# Altium project WatchX.PrjPcb
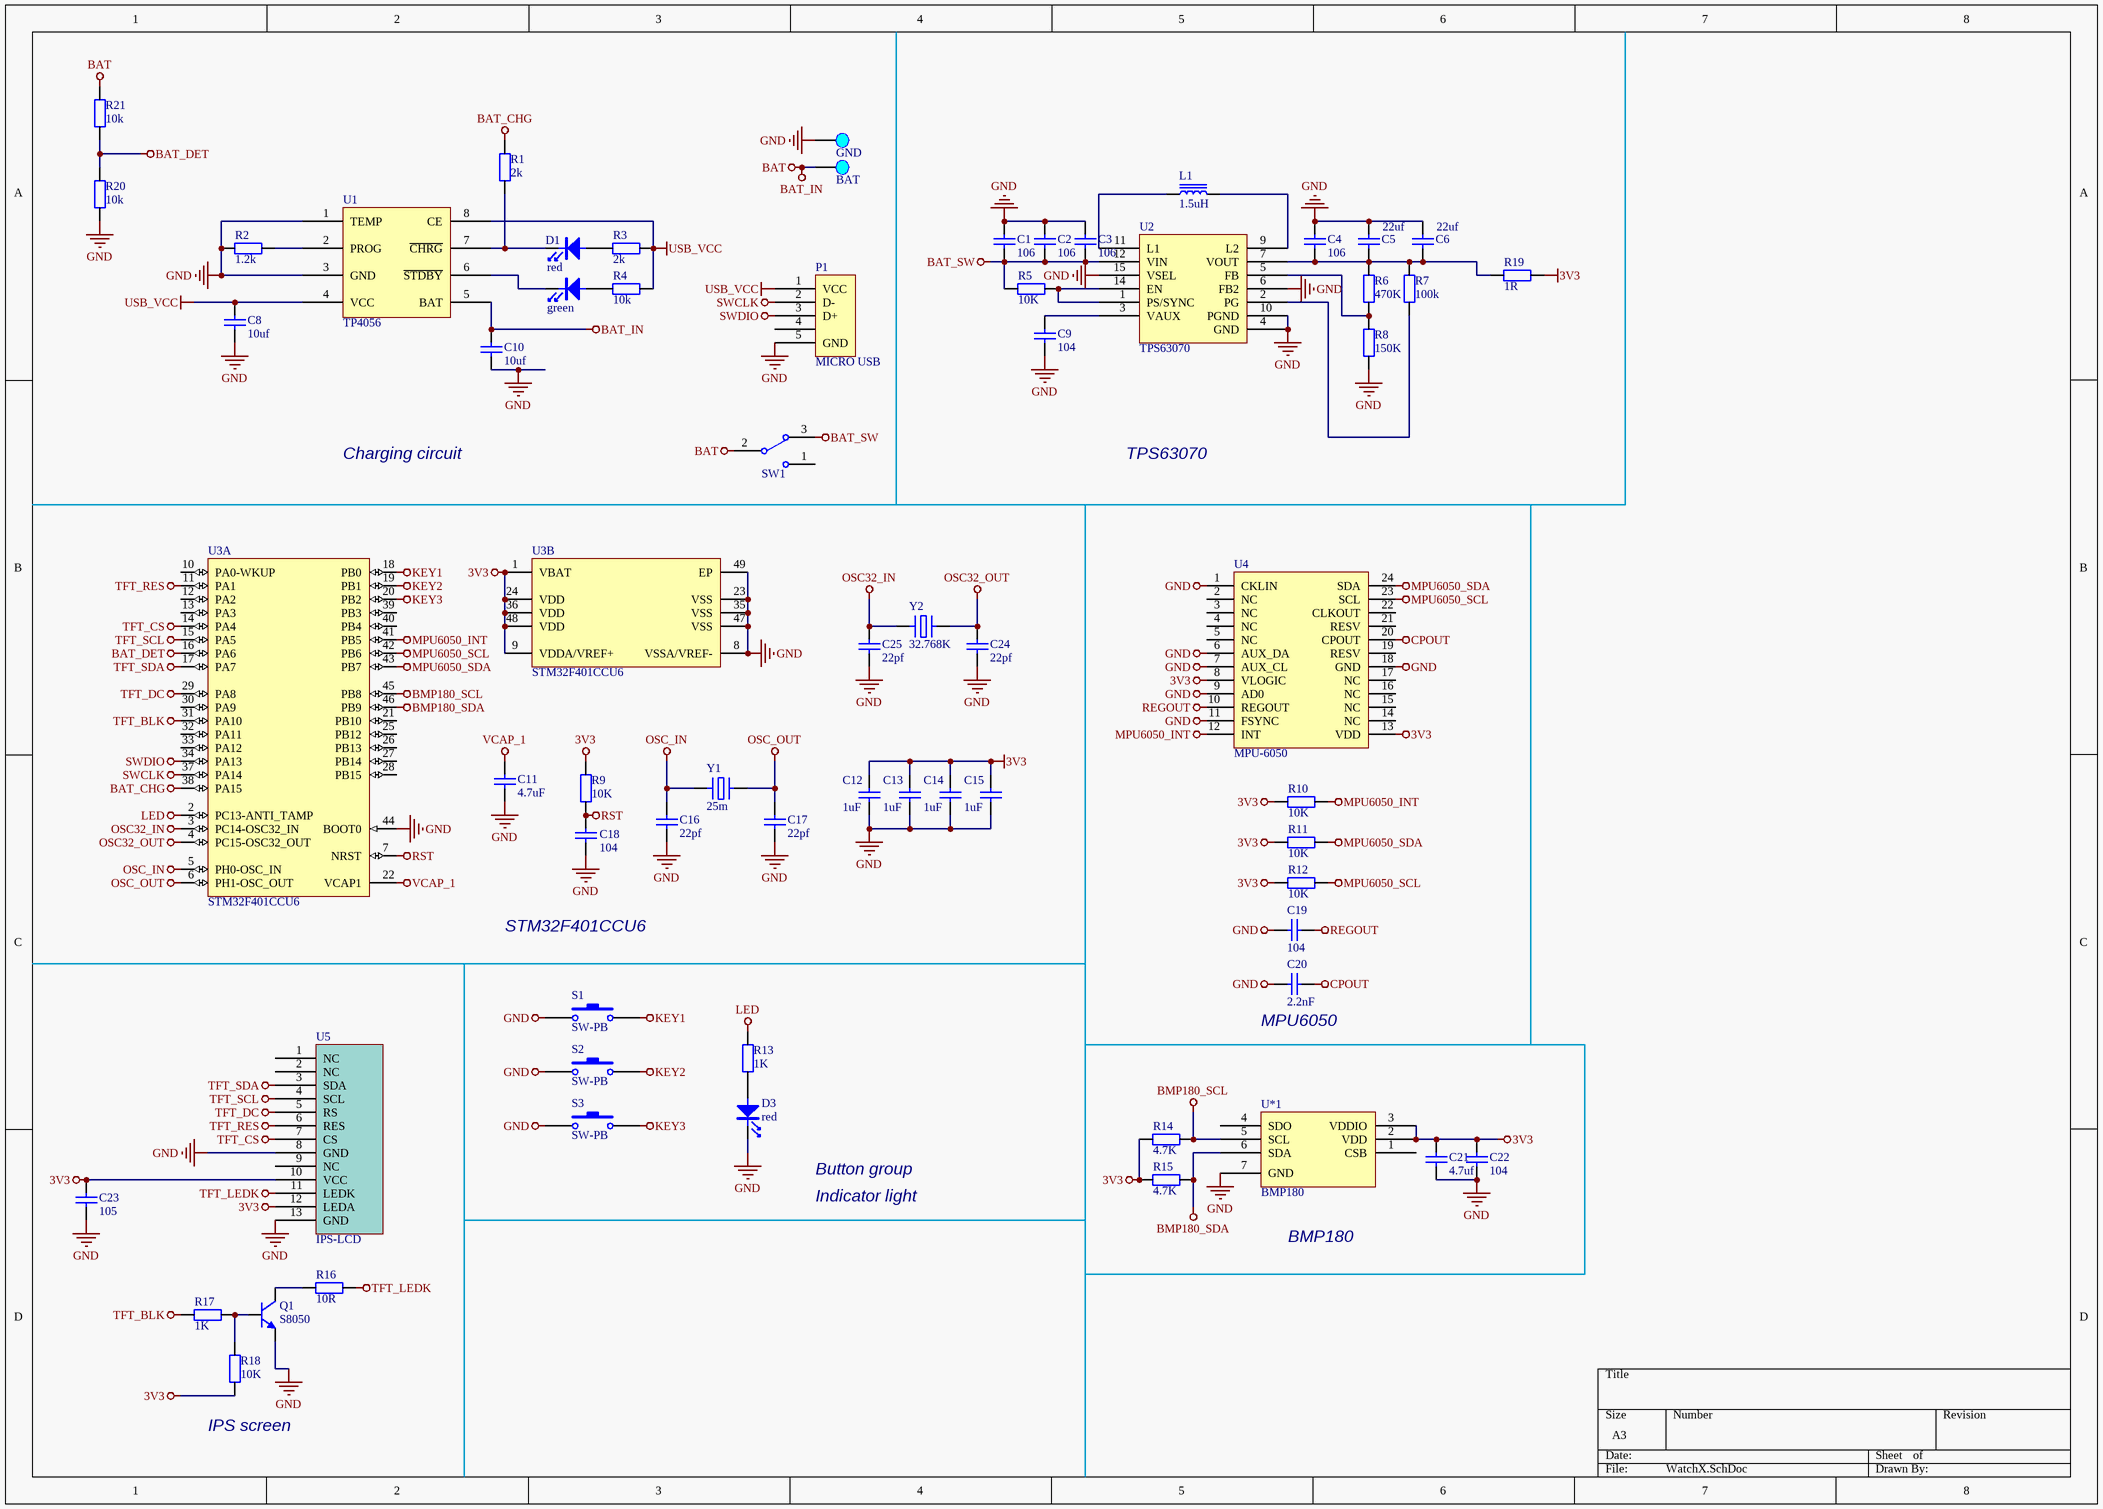
[diagram p0: WatchX.SchDoc]
1 sheet, 65 parts. Net scope: global (net labels, ports and power ports of the same name join across sheets).
Board file: WatchX.PcbDoc

## Sheet WatchX.SchDoc: WatchX
size A3

### Parts
C1  106  [电容_C0805]
C2  106  [电容_C0805]
C3  106  [电容_C0603]
C4  106  [电容_C0603]
C5  22uf  [电容_C1206]
C6  22uf  [电容_C1206]
C8  10uf  [电容_C0603]
C9  104  [电容_C0603]
C10  10uf  [电容_C0603]
C11  4.7uF  [电容_C0603]
C12  1uF  [电容_C0603]
C13  1uF  [电容_C0603]
C14  1uF  [电容_C0603]
C15  1uF  [电容_C0603]
C16  22pf  [电容_C0603]
C17  22pf  [电容_C0603]
C18  104  [电容_C0603]
C19  104  [电容_C0603]
C20  2.2nF  [电容_C0603]
C21  4.7uf  [电容_C0603]
C22  104  [电容_C0603]
C23  105  [电容_C0603]
C24  22pf  [电容_C0603]
C25  22pf  [电容_C0603]
D1  red  [LED_0603]
D2  green  [LED_0603]
D3  red  [LED_0603]
L1  1.5uH  [变压器电感_0420]
P1  MICRO USB  [接插件_MICRO 牛角插座 USB 卷边]
Pad1  GND  [Pad_A]
Pad2  BAT  [Pad_A]
Q1  S8050  [三极管_SOT-23]
R1  2k  [电阻_R0603]
R2  1.2k  [电阻_R0603]
R3  2k  [电阻_R0603]
R4  R: 10k  [电阻_R0603]  (hidden comment: 2k)
R5  10K  [电阻_R0603]
R6  470K  [电阻_R0603]
R7  100k  [电阻_R0603]
R8  150K  [电阻_R0603]
R9  10K  [电阻_R0603]
R10  10K  [电阻_R0603]
R11  10K  [电阻_R0603]
R12  10K  [电阻_R0603]
R13  1K  [电阻_R0603]
R14  4.7K  [电阻_R0603]
R15  4.7K  [电阻_R0603]
R16  10R  [电阻_R0603]
R17  1K  [电阻_R0603]
R18  10K  [电阻_R0603]
R19  1R  [电阻_R0603]
R20  10k  [电阻_R0603]
R21  10k  [电阻_R0603]
S1  SW-PB  [KEY_3.5*4.7]
S2  SW-PB  [KEY_3.5*4.7]
S3  SW-PB  [KEY_3.5*4.7]
SW1  SPDT  [MSS3-Q-T/R]  (value not drawn)
U1  TP4056  [SOP8]
U2  TPS63070  [VQFN-15-HR]
U3  STM32F401CCU6  [STM-UFQFPN48_N]  (parts A,B of 2)
U4  MPU-6050  [陀螺仪_QFN24]
U5  IPS-LCD  [1.14IPS-LCD]
U*1  BMP180  [LGA-7]
Y1  F: 25m  [晶振_2016]  (hidden comment: XTAL)
Y2  32.768K  [晶振_3215]

### Nets
3V3: C12.2 C13.2 C14.2 C15.2 C21.2 C22.2 C23.2 R9.2 R10.2 R11.2 R12.2 R14.2 R15.2 R18.1 R19.2 U3.1(VBAT) U3.9(VDDA/VREF+) U3.24(VDD) U3.36(VDD) U3.48(VDD) U4.8(VLOGIC) U4.13(VDD) U5.10(VCC) U5.12(LEDA) U*1.2(VDD) U*1.3(VDDIO)
BAT: C10.2 Pad2.1 R21.2 SW1.2 U1.5(BAT)  [also labelled BAT_IN]
BAT_CHG: R1.2 U3.38(PA15)
BAT_DET: R20.2 R21.1 U3.16(PA6)
BAT_SW: C1.1 C2.1 C3.1 R5.2 SW1.3 U2.12(VIN)
BMP180_SCL: R14.1 U3.45(PB8) U*1.5(SCL)
BMP180_SDA: R15.1 U3.46(PB9) U*1.6(SDA)
CPOUT: C20.2 U4.20(CPOUT)
GND: C1.2 C2.2 C3.2 C4.2 C5.2 C6.2 C8.1 C9.1 C10.1 C11.1 C12.1 C13.1 C14.1 C15.1 C16.2 C17.2 C18.1 C19.1 C20.1 C21.1 C22.1 C23.1 C24.2 C25.2 D3.K P1.0 P1.5(GND) Pad1.1 Q1.3(E) R2.1 R8.2 R20.1 S1.1 S2.1 S3.1 U1.0(GND) U1.1(TEMP) U1.3(GND) U2.4(GND) U2.6(FB2) U2.10(PGND) U2.15(VSEL) U3.8(VSSA/VREF-) U3.23(VSS) U3.35(VSS) U3.44(BOOT0) U3.47(VSS) U3.49(EP) U4.0 U4.1(CKLIN) U4.6(AUX_DA) U4.7(AUX_CL) U4.9(AD0) U4.11(FSYNC) U4.18(GND) U5.8(GND) U5.13(GND) U*1.7(GND)
KEY1: S1.2 U3.18(PB0)
KEY2: S2.2 U3.19(PB1)
KEY3: S3.2 U3.20(PB2)
LED: R13.1 U3.2(PC13-ANTI_TAMP)
MPU6050_INT: R10.1 U3.41(PB5) U4.12(INT)
MPU6050_SCL: R12.1 U3.42(PB6) U4.23(SCL)
MPU6050_SDA: R11.1 U3.43(PB7) U4.24(SDA)
OSC32_IN: C25.1 U3.3(PC14-OSC32_IN) Y2.1
OSC32_OUT: C24.1 U3.4(PC15-OSC32_OUT) Y2.2
OSC_IN: C16.1 U3.5(PH0-OSC_IN) Y1.1
OSC_OUT: C17.1 U3.6(PH1-OSC_OUT) Y1.2
REGOUT: C19.2 U4.10(REGOUT)
RST: C18.2 R9.1 U3.7(NRST)
SWCLK: P1.2(D-) U3.37(PA14)
SWDIO: P1.3(D+) U3.34(PA13)
TFT_BLK: R17.1 U3.31(PA10)
TFT_CS: U3.14(PA4) U5.7(CS)
TFT_DC: U3.29(PA8) U5.5(RS)
TFT_LEDK: R16.2 U5.11(LEDK)
TFT_RES: U3.11(PA1) U5.6(RES)
TFT_SCL: U3.15(PA5) U5.4(SCL)
TFT_SDA: U3.17(PA7) U5.3(SDA)
USB_VCC: C8.2 P1.1(VCC) R3.2 R4.2 U1.4(VCC) U1.8(CE)
VCAP_1: C11.2 U3.22(VCAP1)
NetC4_1: C4.1 C5.1 C6.1 R6.1 R7.1 R19.1 U2.7(VOUT)
NetC9_2: C9.2 U2.3(VAUX)
NetD1_A: D1.A R3.1
NetD1_K: D1.K R1.1 U1.7(~{CHRG})
NetD2_A: D2.A R4.1
NetD2_K: D2.K U1.6(~{STDBY})
NetD3_A: D3.A R13.2
NetL1_1: L1.1 U2.11(L1)
NetL1_2: L1.2 U2.9(L2)
NetQ1_1: Q1.1(B) R17.2 R18.2
NetQ1_2: Q1.2(C) R16.1
NetR2_2: R2.2 U1.2(PROG)
NetR5_1: R5.1 U2.1(PS/SYNC) U2.14(EN)
NetR6_2: R6.2 R8.1 U2.5(FB)
NetR7_2: R7.2 U2.2(PG)

Not connected (* = marked no-connect by the designer): P1 4; SW1 1; U3 10(PA0-WKUP) 12(PA2) 13(PA3) 21(PB10) 25(PB12) 26(PB13) 27(PB14) 28(PB15) 30(PA9) 32(PA11) 33(PA12) 39(PB3) 40(PB4); U4 2(NC) 3(NC) 4(NC) 5(NC) 14(NC) 15(NC) 16(NC) 17(NC) 19(RESV) 21(RESV) 22(CLKOUT); U5 1(NC) 2(NC) 9(NC); U*1 1(CSB) 4(SDO)

### Notes on the sheet
- Charging circuit
- TPS63070
- STM32F401CCU6
- (near C20) MPU6050
- Button group
- Indicator light
- BMP180
- (near R18) IPS screen

### Library data of the parts
C1-C6 C8-C25 = cap: U: 50V; 参数: Cap,0805,X7R,104K,50V,125C,±10%
  C1-C4: C: 106
  C5 C6: C: 22uf
  C8 C10: C: 10uf
  C9 C18 C19 C22: C: 104
  C11: C: 4.7uF
  C12-C15: C: 1uF
  C16 C17 C24 C25: C: 22pf
  C20: C: 2.2nF
  C21: C: 4.7uf
  C23: C: 105
D1-D3 = LED: 参数: LED,0603,Red
L1 = Inductor Iron 2: _Current: 10A; _Accuracy: 20%; _Footprint: 1040; _Name: IND; _Specification: IND,1040,1.5uH,10A,20%; _Comma: ,; _Value: 1.5uH
P1 = MICRO USB 5PIN: _Comma: ,; _Name: Port; _Specification: Port,MICRO USB,5PIN; _Value: 5PIN; _Model: MICRO USB
Pad1 = Pad: _Funcyusa: Test; _Specification: Pad,Test,GND; _Comma: ,; _Name: Pad; _Remarks: GND
Pad2 = Pad: _Funcyusa: Test; _Specification: Pad,Test,BAT; _Comma: ,; _Name: Pad; _Remarks: BAT
Q1 = Triode-NPN: _Comma: ,; _Current: 500mA; _Footprint: SOT-23; _Name: Triode; _Specification: Triode,NPN,S8050,SOT-23,500mA,40V; _Voltage: 40V; _Polarity: NPN; _Model: S8050
R1-R15 R19-R21 = Res: P: 1/8W; 参数: Res,0805,0R,±1%,1/8W,100ppm,155C
  R1 R3: R: 2k
  R2: R: 1.2k
  R5 R9-R12: R: 10K
  R6: R: 470K
  R7: R: 100k
  R8: R: 150K
  R13: R: 1K
  R14 R15: R: 4.7K
  R19: R: 1R
  R20 R21: R: 10k
R16 = Res: _Accuracy: 1%; _Power: 1/8W; _Footprint: 0805; _Drift: 100ppm; _Comma: ,; _Specification: Res,0805,10R,1%,1/8W,100ppm; _Name: Res; _Value: 10R
R17 = Res: _Accuracy: 1%; _Power: 1/8W; _Footprint: 0805; _Drift: 100ppm; _Comma: ,; _Specification: Res,0805,1K,1%,1/8W,100ppm; _Name: Res; _Value: 1K
R18 = Res: _Accuracy: 1%; _Power: 1/8W; _Footprint: 0805; _Drift: 100ppm; _Comma: ,; _Specification: Res,0805,10K,1%,1/8W,100ppm; _Name: Res; _Value: 10K
S1-S3 = SW-PB: 按键
SW1 = SW_SPDT: 开关-两档
U1 = TP4056: 参数: Charge Control,LP4056,ESOP-8
U2 = TPS63070: 降压-升压转换器
U3 = STM32F401CCU6: ARM Cortex-M4 32-bit MCU+FPU, 105 DMIPS, 256 kB Flash, 64 kB Internal RAM, 36 I/Os, 48-pin UFQFPN, -40 to 85 degC, Tray; Manufacturer: STMicroelectronics; FLASH Size (Prog) (kB): 256; I/Os (High Current): 36; Internal RAM Size (kB): 64; Operating Frequency(F) (Processor speed) (MHz): 84; Supply Voltage(Vcc) max (V): 3.6; Supply Voltage(Vcc) min (V): 1.8; DatasheetVersion: Rev. 1; PackageVersion: Rev. 1, 04/2013; PackageReference: UFQFPN48; PackageDescription: 48-Pin Ultra Thin Fine Pitch Quad Flat No-Lead, 7 x 7 x 0.6 mm Body, 0.5 mm Pitch, Exposed Pad; Supplier 1: Newark; Supplier Part Number 1: 19X6217; Supplier 2: Mouser; Supplier Part Number 2: 511-STM32F401CCU6; Core: ARM Cortex-M4; Packing: Tray; Mounting Technology: Surface Mount; PartNumber: STM32F401CCU6; ComponentLink1Description: Manufacturer URL; ComponentLink1URL: http://www.st.com/web/en/home.html; ComponentLink2Description: Datasheet; ComponentLink2URL: http://www.st.com/st-web-ui/static/active/en/resource/technical/document/data_brief/DM00071938.pdf; ComponentLink3Description: Package Specification; ComponentLink3URL: http://www.st.com/st-web-ui/static/active/en/resource/technical/document/data_brief/DM00071938.pdf
U5 = IPS-LCD-1.14: IPS-LCD-1.14寸裸屏spi接口
U*1 = BMP180: 数字气压传感器
Y2 = XTAL_A: _Name: CRYSTALS; _Comma: ,; _Specification: CRYSTALS,32.768K,*,10ppm,12pF; _Accuracy: 10ppm; _CL: 12pF; _Footprint: *; _Frequency: 32.768K